# Altium schematic sheet Mechanik.SchDoc
size A4; SheetNumber: 7; SheetTotal: 7
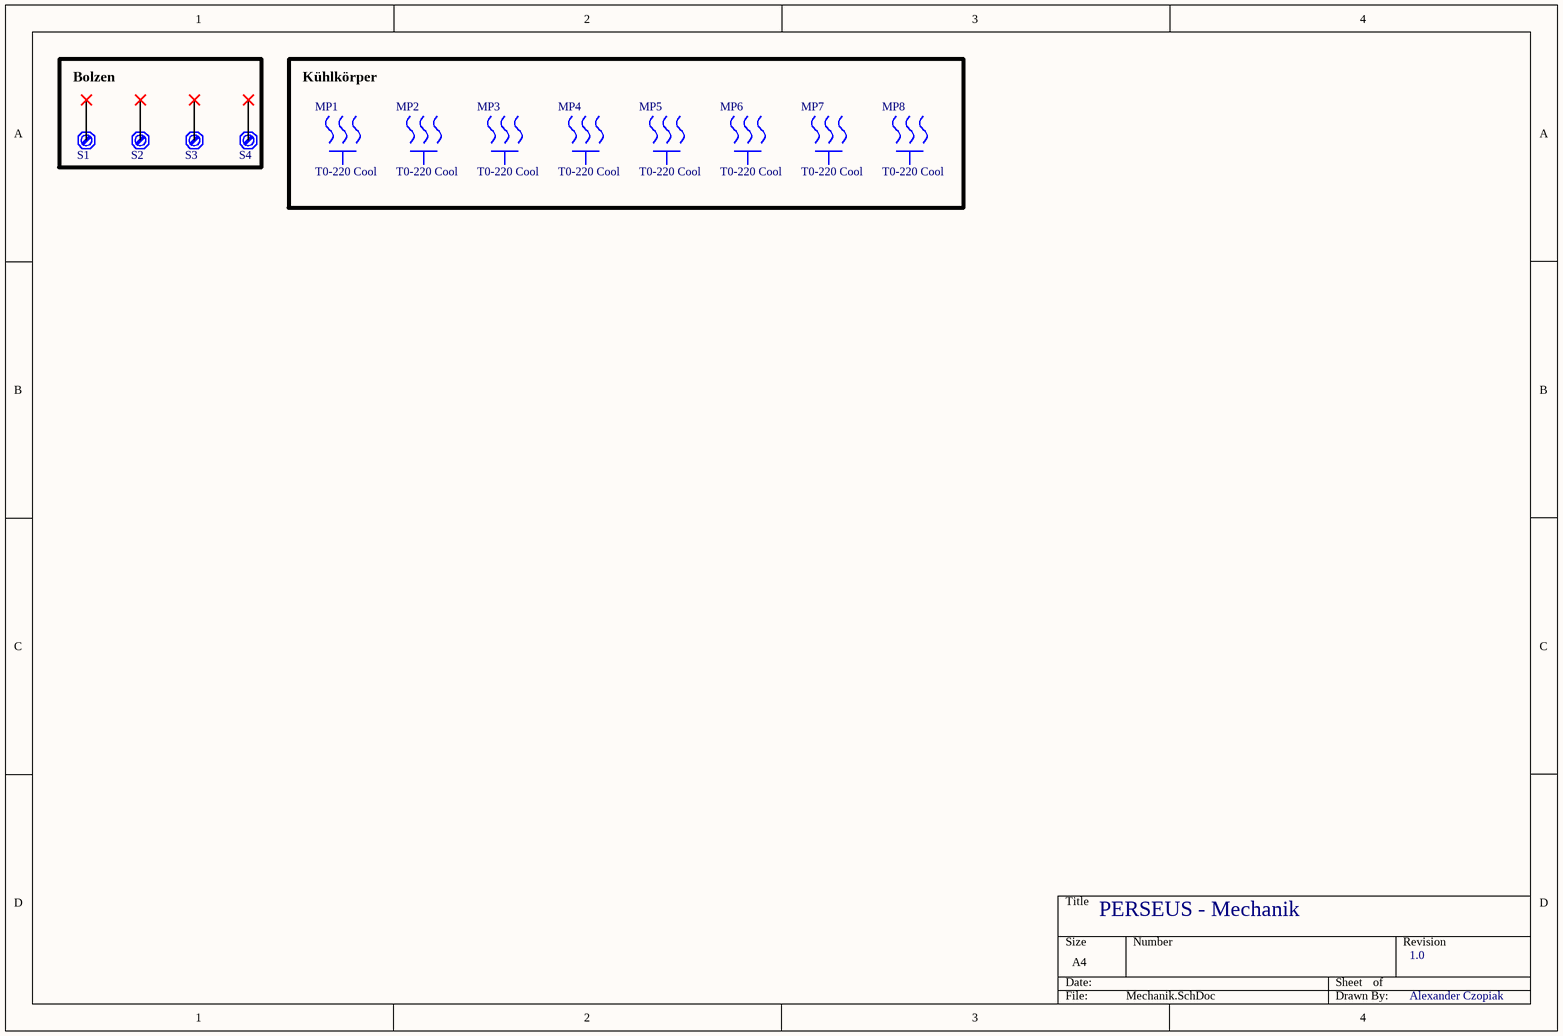
[diagram p0: Mechanik.SchDoc]

## Parts
MP1  T0-220 Cool  [TO-220 Cool]
MP2  T0-220 Cool  [TO-220 Cool]
MP3  T0-220 Cool  [TO-220 Cool]
MP4  T0-220 Cool  [TO-220 Cool]
MP5  T0-220 Cool  [TO-220 Cool]
MP6  T0-220 Cool  [TO-220 Cool]
MP7  T0-220 Cool  [TO-220 Cool]
MP8  T0-220 Cool  [TO-220 Cool]
S1  (no value)  [M3]
S2  (no value)  [M3]
S3  (no value)  [M3]
S4  (no value)  [M3]

## Blocks framed on the sheet
Bolzen: S1-S4
Kühlkörper: MP1-MP8

## Nets

Not connected (* = marked no-connect by the designer): S1 1*; S2 1*; S3 1*; S4 1*

## Notes on the sheet
- PERSEUS - Mechanik
- 1.0
- Alexander Czopiak

## Library data of the parts
MP1-MP8 = Kuehlkoerper TO-220: HEAT SINK TO-220 .500" COMPACT 577202B00000G; Natural Thermal Resistance: 24.4°C/W; Thermal Resistance @ Forced Air Flow (100 LFM): 10°C/W; Finish: Anodized; Shape: Fins; Weight: 0.25lb; Height: 12.7mm; Lead Free: Lead Free; Material: Aluminium; Case/Package: TO-220; Package Cooled: TO-220; REACH SVHC: No SVHC; Type: Passive; Radiation Hardening: No; Height Off Base: 0.5inch; Package Quantity: 2000; Packaging: Bulk; Color: Black; Mount: Bolt; RoHS Compliant: Yes; Width: 0.52inch; Length: 19.05mm; Depth: 13.21mm
S1-S4 = SCHRAUBE/BOLZEN